# Altium schematic sheet FMB-STM32.SchDoc
size A3
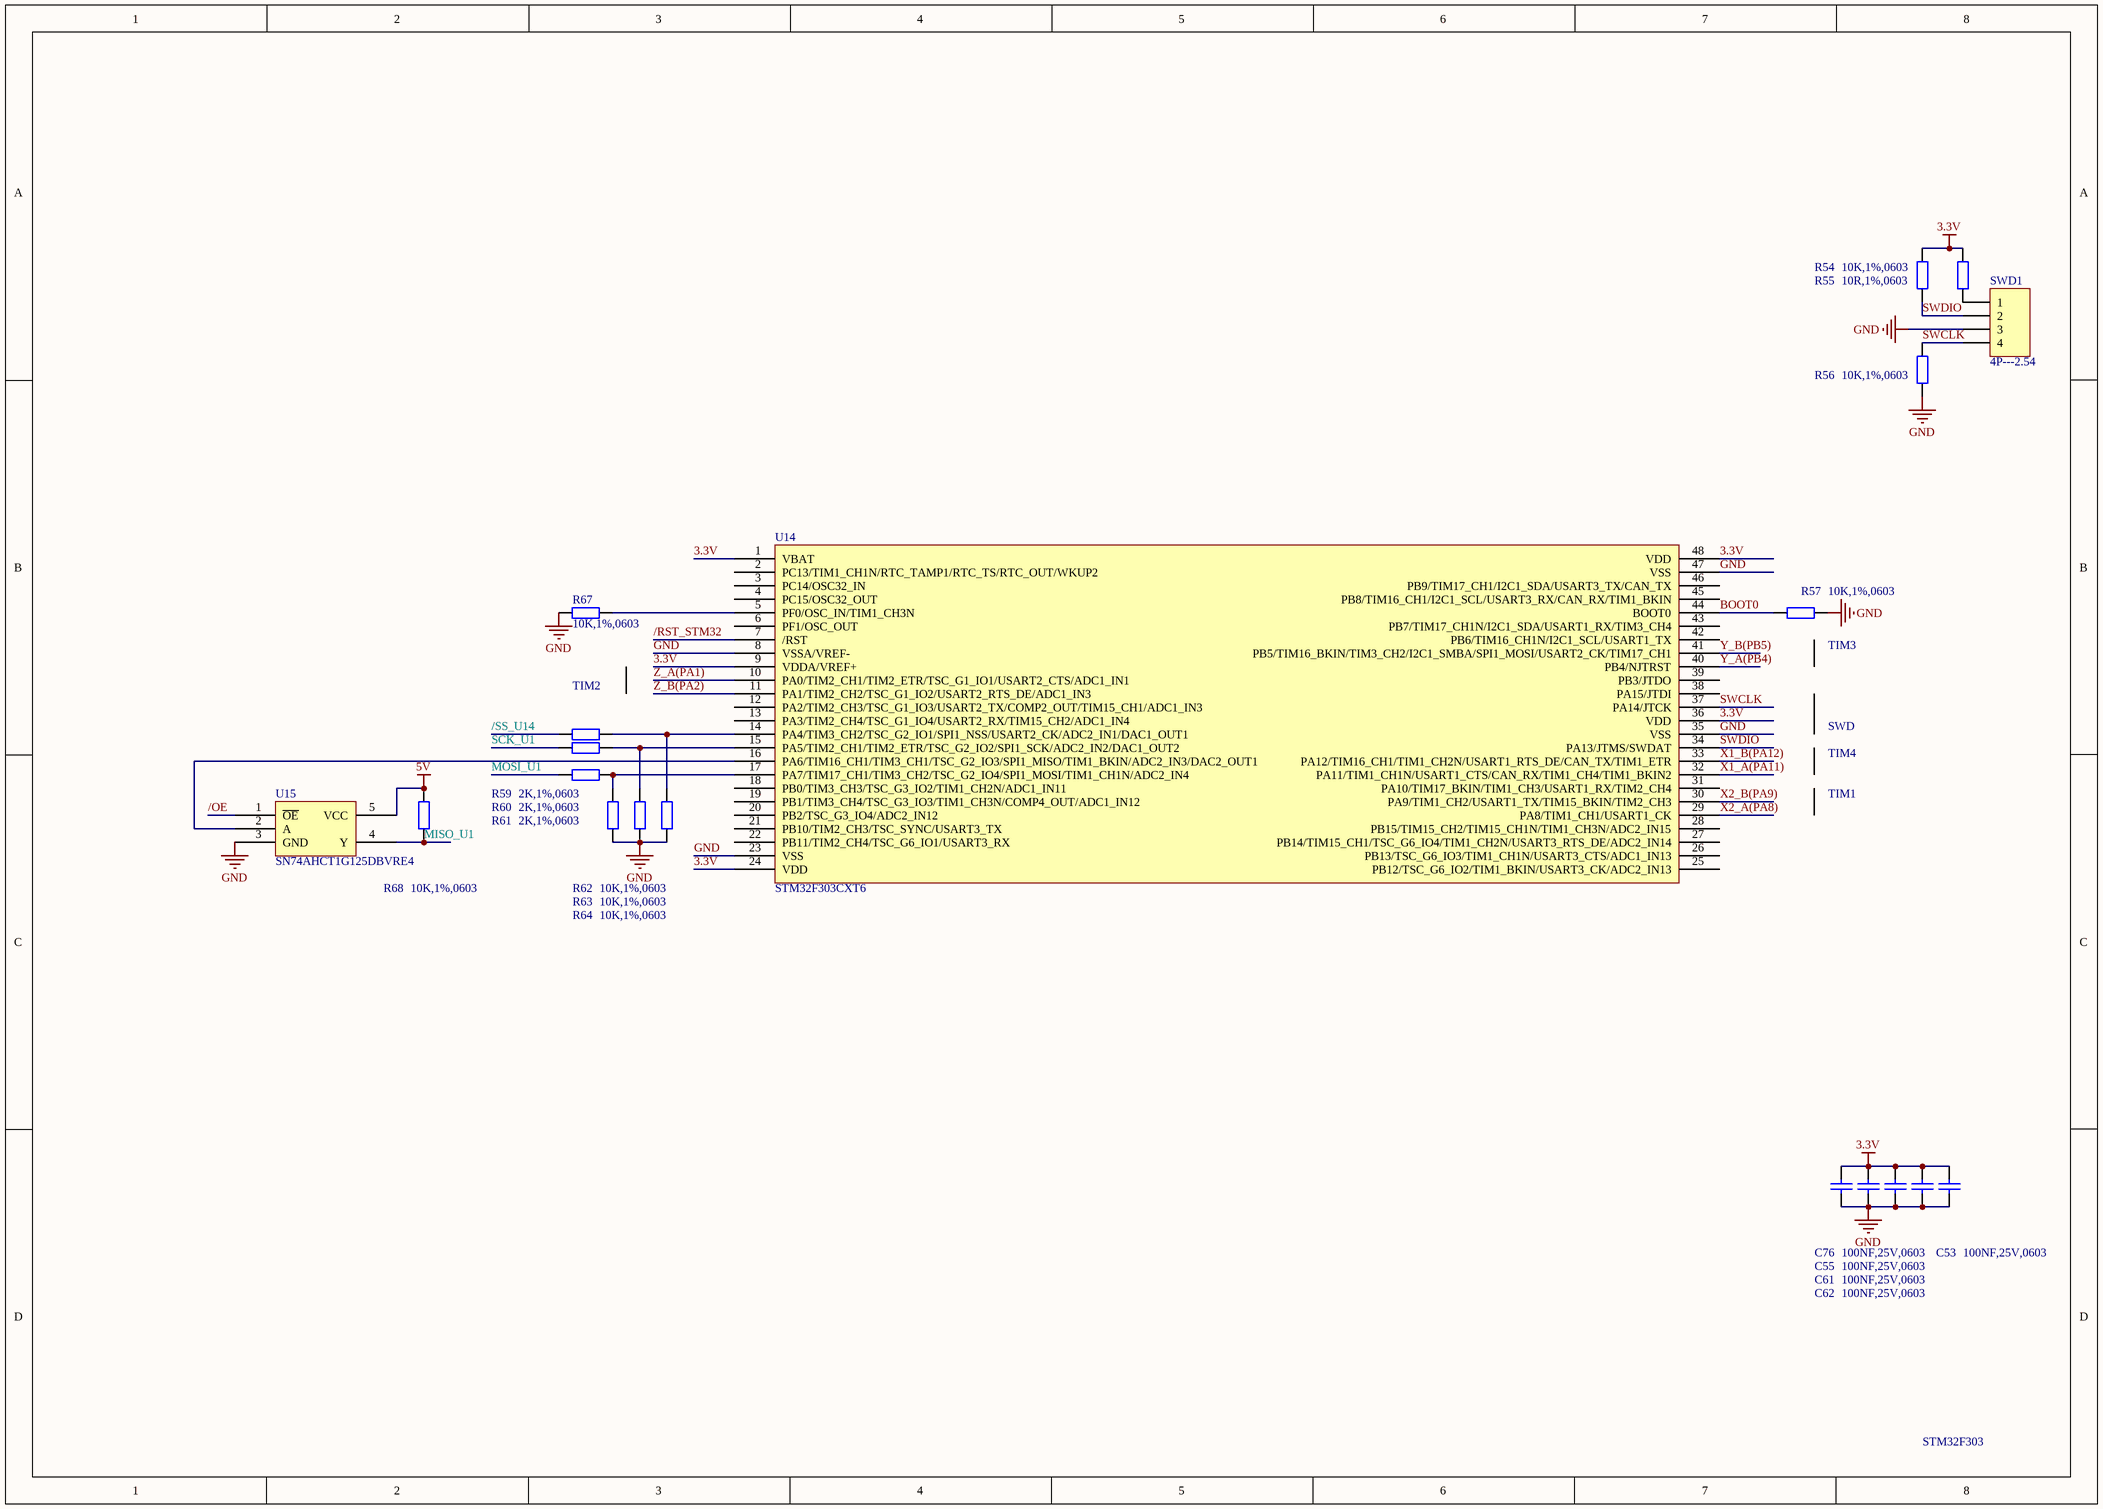
[diagram p0: FMB-STM32.SchDoc]

## Parts
C53  100NF,25V,0603  [RC0603]
C55  100NF,25V,0603  [RC0603]
C61  100NF,25V,0603  [RC0603]
C62  100NF,25V,0603  [RC0603]
C76  100NF,25V,0603  [RC0603]
R54  10K,1%,0603  [RC0603]
R55  10R,1%,0603  [RC0603]
R56  10K,1%,0603  [RC0603]
R57  10K,1%,0603  [RC0603]
R59  2K,1%,0603  [RC0603]
R60  2K,1%,0603  [RC0603]
R61  2K,1%,0603  [RC0603]
R62  10K,1%,0603  [RC0603]
R63  10K,1%,0603  [RC0603]
R64  10K,1%,0603  [RC0603]
R67  10K,1%,0603  [RC0603]
R68  10K,1%,0603  [RC0603]
SWD1  4P---2.54  [HDR1X4]
U14  STM32F303CXT6  [LQFP-48]
U15  SN74AHCT1G125DBVRE4  [SOT-23-5]

## Nets
3.3V: C53.1 C55.1 C61.1 C62.1 C76.1 R54.1 R55.1 U14.1(VBAT) U14.9(VDDA/VREF+) U14.24(VDD) U14.36(VDD) U14.48(VDD)
5V: R68.2 U15.5(VCC)
GND: C53.2 C55.2 C61.2 C62.2 C76.2 R56.1 R57.1 R62.1 R63.1 R64.1 R67.2 SWD1.3 U14.8(VSSA/VREF-) U14.23(VSS) U14.35(VSS) U14.47(VSS) U15.3(GND)
/OE: U15.1(~{OE})
/RST_STM32: U14.7(/RST)
/SS_U14: R59.1
BOOT0: R57.2 U14.44(BOOT0)
MISO_U1: R68.1 U15.4(Y)
MOSI_U1: R61.1
SCK_U1: R60.1
SWCLK: R56.2 SWD1.4 U14.37(PA14/JTCK)
SWDIO: R54.2 SWD1.2 U14.34(PA13/JTMS/SWDAT)
X1_A(PA11): U14.32(PA11/TIM1_CH1N/USART1_CTS/CAN_RX/TIM1_CH4/TIM1_BKIN2)
X1_B(PA12): U14.33(PA12/TIM16_CH1/TIM1_CH2N/USART1_RTS_DE/CAN_TX/TIM1_ETR)
X2_A(PA8): U14.29(PA8/TIM1_CH1/USART1_CK)
X2_B(PA9): U14.30(PA9/TIM1_CH2/USART1_TX/TIM15_BKIN/TIM2_CH3)
Y_A(PB4): U14.40(PB4/NJTRST)
Y_B(PB5): U14.41(PB5/TIM16_BKIN/TIM3_CH2/I2C1_SMBA/SPI1_MOSI/USART2_CK/TIM17_CH1)
Z_A(PA1): U14.10(PA0/TIM2_CH1/TIM2_ETR/TSC_G1_IO1/USART2_CTS/ADC1_IN1)
Z_B(PA2): U14.11(PA1/TIM2_CH2/TSC_G1_IO2/USART2_RTS_DE/ADC1_IN3)
NetR55_2: R55.2 SWD1.1
NetR59_2: R59.2 R64.2 U14.14(PA4/TIM3_CH2/TSC_G2_IO1/SPI1_NSS/USART2_CK/ADC2_IN1/DAC1_OUT1)
NetR60_2: R60.2 R63.2 U14.15(PA5/TIM2_CH1/TIM2_ETR/TSC_G2_IO2/SPI1_SCK/ADC2_IN2/DAC1_OUT2)
NetR61_2: R61.2 R62.2 U14.17(PA7/TIM17_CH1/TIM3_CH2/TSC_G2_IO4/SPI1_MOSI/TIM1_CH1N/ADC2_IN4)
NetR67_1: R67.1 U14.5(PF0/OSC_IN/TIM1_CH3N)
NetU14_16: U14.16(PA6/TIM16_CH1/TIM3_CH1/TSC_G2_IO3/SPI1_MISO/TIM1_BKIN/ADC2_IN3/DAC2_OUT1) U15.2(A)

Not connected (* = marked no-connect by the designer): U14 2(PC13/TIM1_CH1N/RTC_TAMP1/RTC_TS/RTC_OUT/WKUP2) 3(PC14/OSC32_IN) 4(PC15/OSC32_OUT) 6(PF1/OSC_OUT) 12(PA2/TIM2_CH3/TSC_G1_IO3/USART2_TX/COMP2_OUT/TIM15_CH1/ADC1_IN3) 13(PA3/TIM2_CH4/TSC_G1_IO4/USART2_RX/TIM15_CH2/ADC1_IN4) 18(PB0/TIM3_CH3/TSC_G3_IO2/TIM1_CH2N/ADC1_IN11) 19(PB1/TIM3_CH4/TSC_G3_IO3/TIM1_CH3N/COMP4_OUT/ADC1_IN12) 20(PB2/TSC_G3_IO4/ADC2_IN12) 21(PB10/TIM2_CH3/TSC_SYNC/USART3_TX) 22(PB11/TIM2_CH4/TSC_G6_IO1/USART3_RX) 25(PB12/TSC_G6_IO2/TIM1_BKIN/USART3_CK/ADC2_IN13) 26(PB13/TSC_G6_IO3/TIM1_CH1N/USART3_CTS/ADC1_IN13) 27(PB14/TIM15_CH1/TSC_G6_IO4/TIM1_CH2N/USART3_RTS_DE/ADC2_IN14) 28(PB15/TIM15_CH2/TIM15_CH1N/TIM1_CH3N/ADC2_IN15) 31(PA10/TIM17_BKIN/TIM1_CH3/USART1_RX/TIM2_CH4) 38(PA15/JTDI) 39(PB3/JTDO) 42(PB6/TIM16_CH1N/I2C1_SCL/USART1_TX) 43(PB7/TIM17_CH1N/I2C1_SDA/USART1_RX/TIM3_CH4) 45(PB8/TIM16_CH1/I2C1_SCL/USART3_RX/CAN_RX/TIM1_BKIN) 46(PB9/TIM17_CH1/I2C1_SDA/USART3_TX/CAN_TX)

## Notes on the sheet
- (near R57) TIM3
- TIM2
- SWD
- TIM4
- TIM1
- STM32F303

## Library data of the parts
C53 C55 C61 C62 C76 = Cap: Capacitor; Value: 100pF; Published: 8-Jun-2000; LatestRevisionDate: 17-Jul-2002; LatestRevisionNote: Re-released for DXP Platform.; PackageReference: RAD-0.3; Publisher: Altium Limited; PackageDescription: Radial Cap, Thru-Hole; 2 Leads; 0.3 in Pin Spacing
R54-R57 R59-R64 R67 R68 = Res2: Resistor; Value: 1K; Published: 8-Jun-2000; LatestRevisionDate: 17-Jul-2002; LatestRevisionNote: Re-released for DXP Platform.; PackageReference: AXIAL-0.4; Publisher: Altium Limited; PackageDescription: Axial Device, Thru-Hole; 2 Leads; 0.4 in Pin Spacing
SWD1 = Header 4: Header, 4-Pin; LatestRevisionDate: 17-Jul-2002; LatestRevisionNote: Re-released for DXP Platform.; Publisher: Altium Limited
U14 = STM32F303
U15 = 74AHCT1G125